# EAGLE schematic temperature-sensor (EAGLE 4.16)
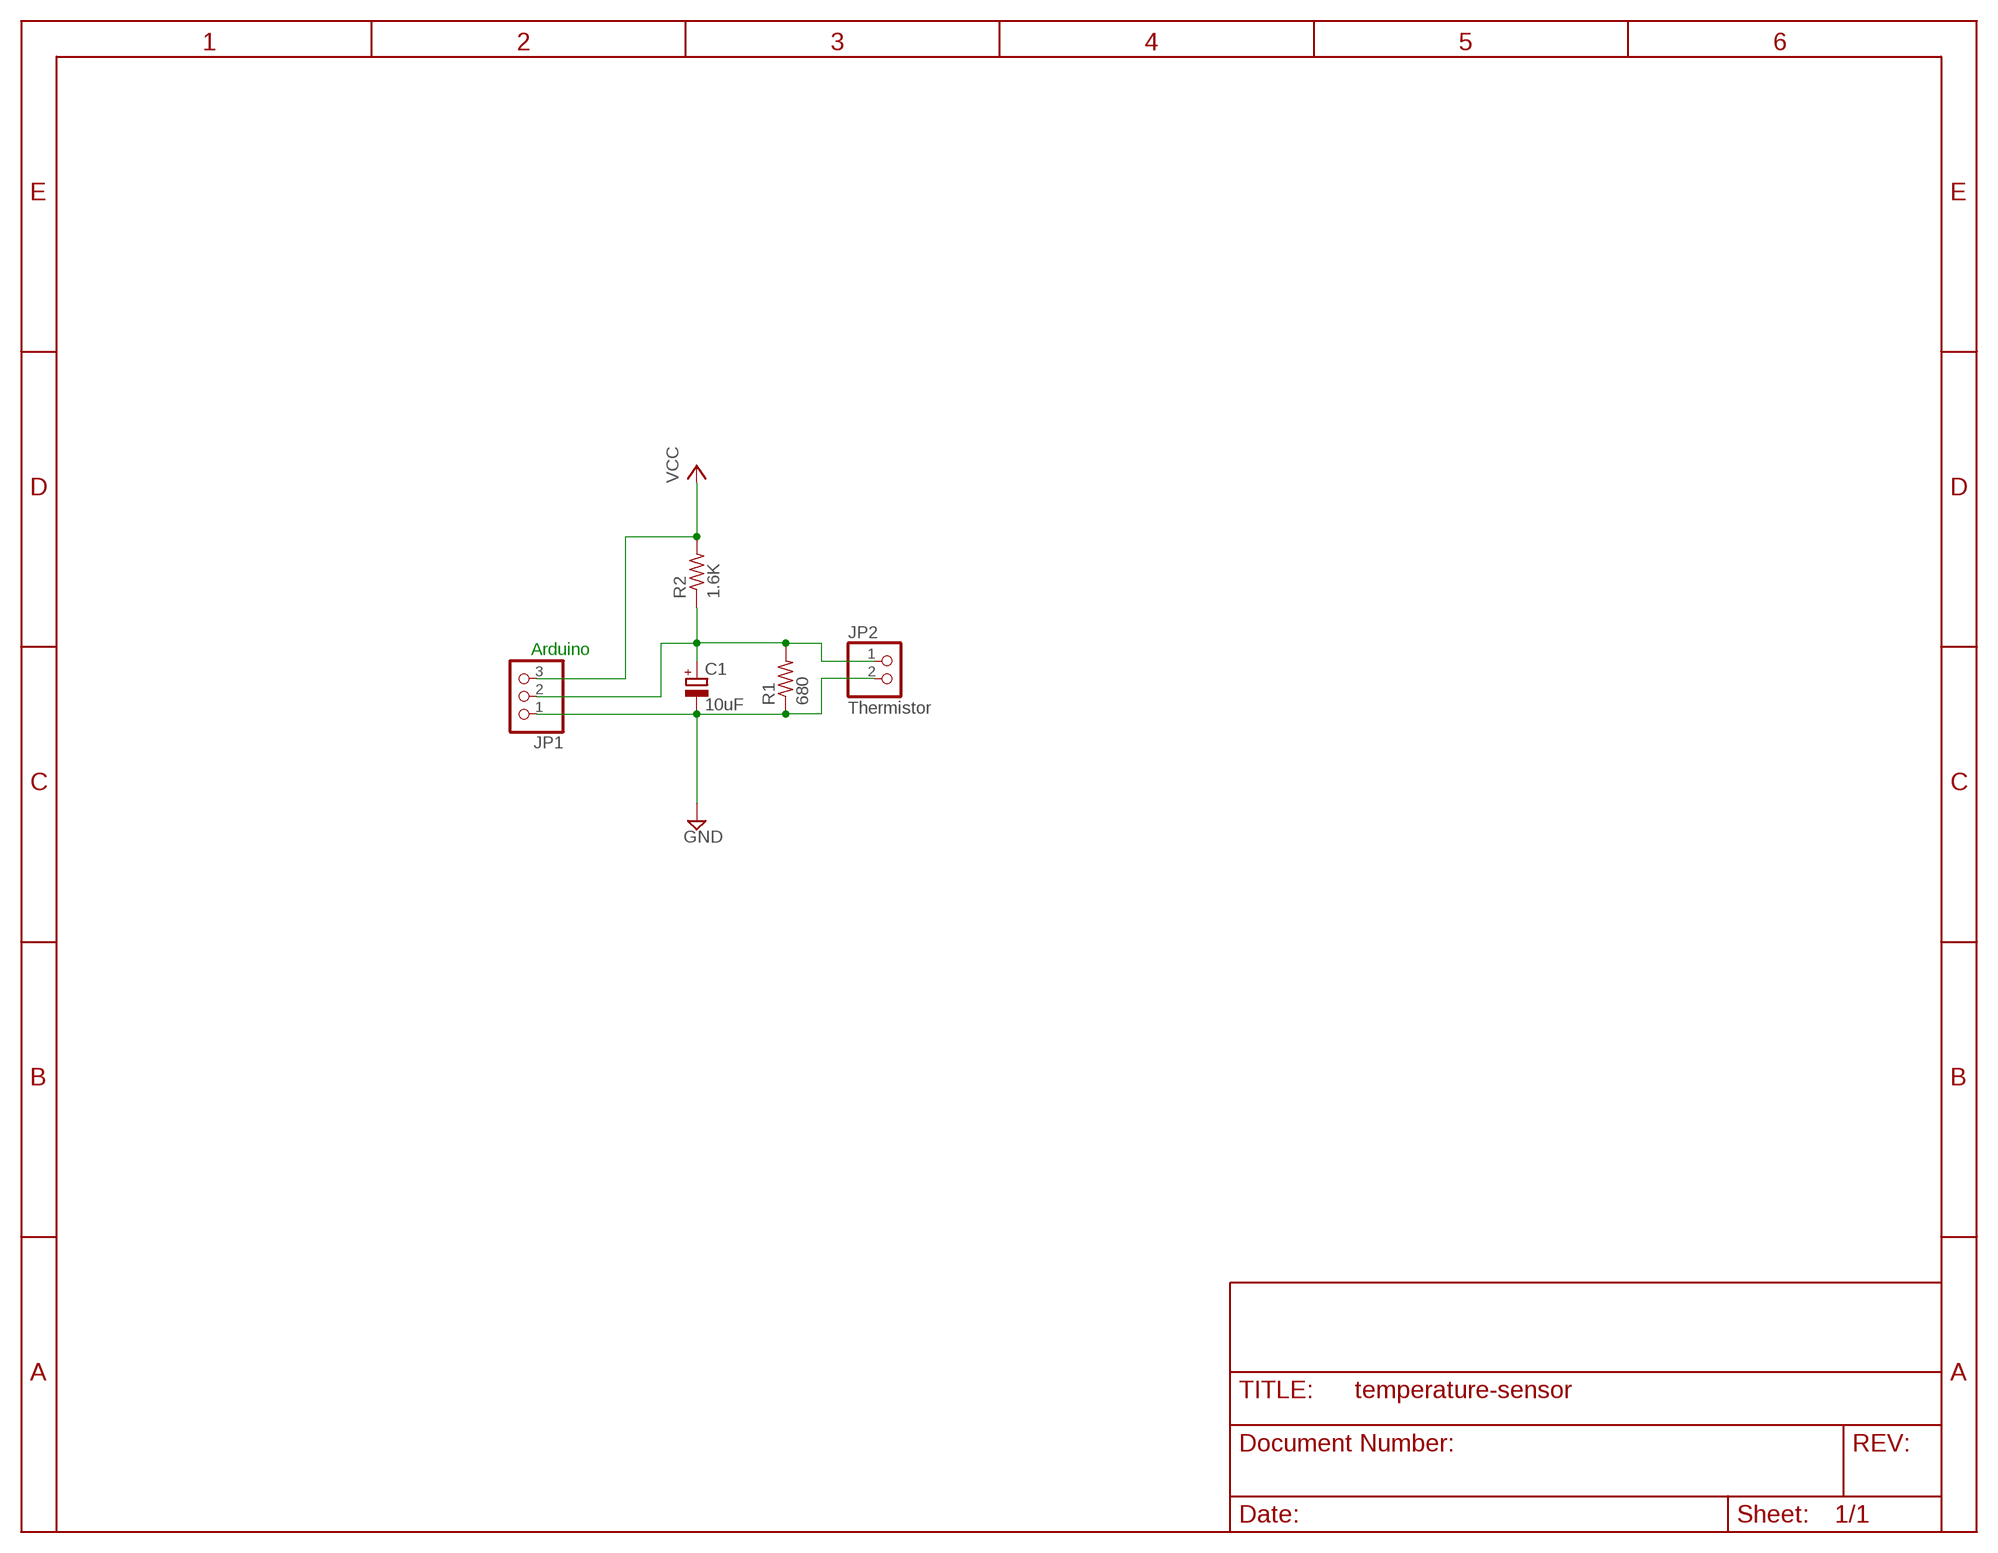
[diagram p0: schematic, sheet 1]

## Parts
C1  10uF  CPOL-EUE5-6  [E5-6]
JP1  PINHD-1X3  [1X03]
JP2  Thermistor  PINHD-1X2  [1X02]
R1  680  R-US_0207/7  [0207/7]
R2  1.6K  R-US_0207/7  [0207/7]

## Nets
GND: C1.- JP1.1 JP2.2 R1.1
N$2: C1.+ JP1.2 JP2.1 R1.2 R2.1
VCC: JP1.3 R2.2

## Notes on the sheet
- Arduino

## Library data of the parts
C1 = rcl:CPOL-EU: POLARIZED CAPACITOR, European symbol
JP1 = pinhead:PINHD-1X3: PIN HEADER
JP2 = pinhead:PINHD-1X2: PIN HEADER
R1 R2 = rcl:R-US_: RESISTOR, American symbol

## Net classes
0 default: width 0.635 mm